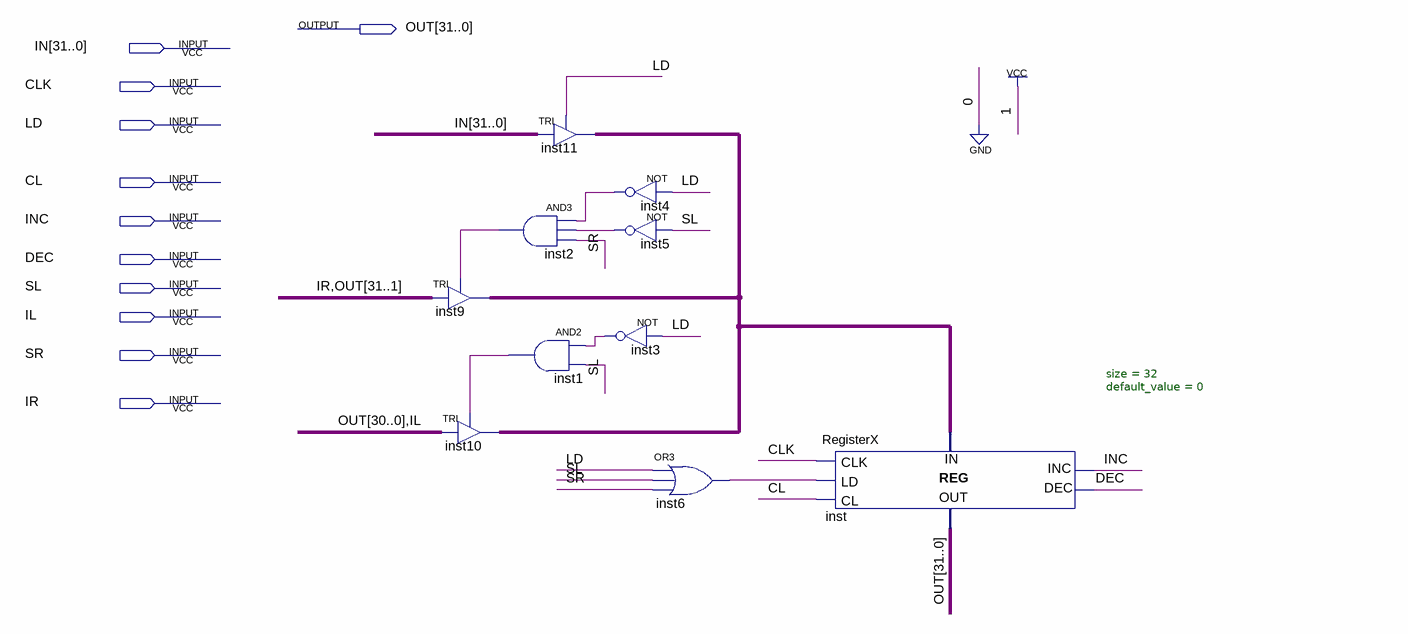
[diagram p0: schematic sheet]
// Quartus schematic Register32_SHIFT.bdf as structural Verilog: 10 symbols, 11 pins
module Register32_SHIFT (
  input  [31:0] IN,
  input  CLK,
  input  LD,
  input  CL,
  input  INC,
  input  DEC,
  input  SL,
  input  IL,
  input  SR,
  input  IR,
  output [31:0] OUT
);

  wire inst1_out, inst2_out, inst3_out, inst4_out, inst5_out, inst6_out;
  wire [31:0] inst9_out;

  TRI inst9[31:0] (.IN({IR, OUT[31:1]}), .OE(inst2_out), .OUT(inst9_out));
  TRI inst10[31:0] (.IN({OUT[30:0], IL}), .OE(inst1_out), .OUT(inst9_out));
  TRI inst11[31:0] (.IN(IN), .OE(LD), .OUT(inst9_out));
  and inst2 (inst2_out, inst4_out, inst5_out, SR);
  and inst1 (inst1_out, inst3_out, SL);
  not inst4 (inst4_out, LD);
  not inst5 (inst5_out, SL);
  not inst3 (inst3_out, LD);
  or inst6 (inst6_out, LD, SL, SR);
  RegisterX #(.size(32), .default_value(0)) inst (
    .CLK(CLK), .LD(inst6_out), .CL(CL), .INC(INC), .DEC(DEC), .DATA_IN(inst9_out), .DATA_OUT(OUT));
endmodule
